# Altium project P10_ESP32.PrjPcb
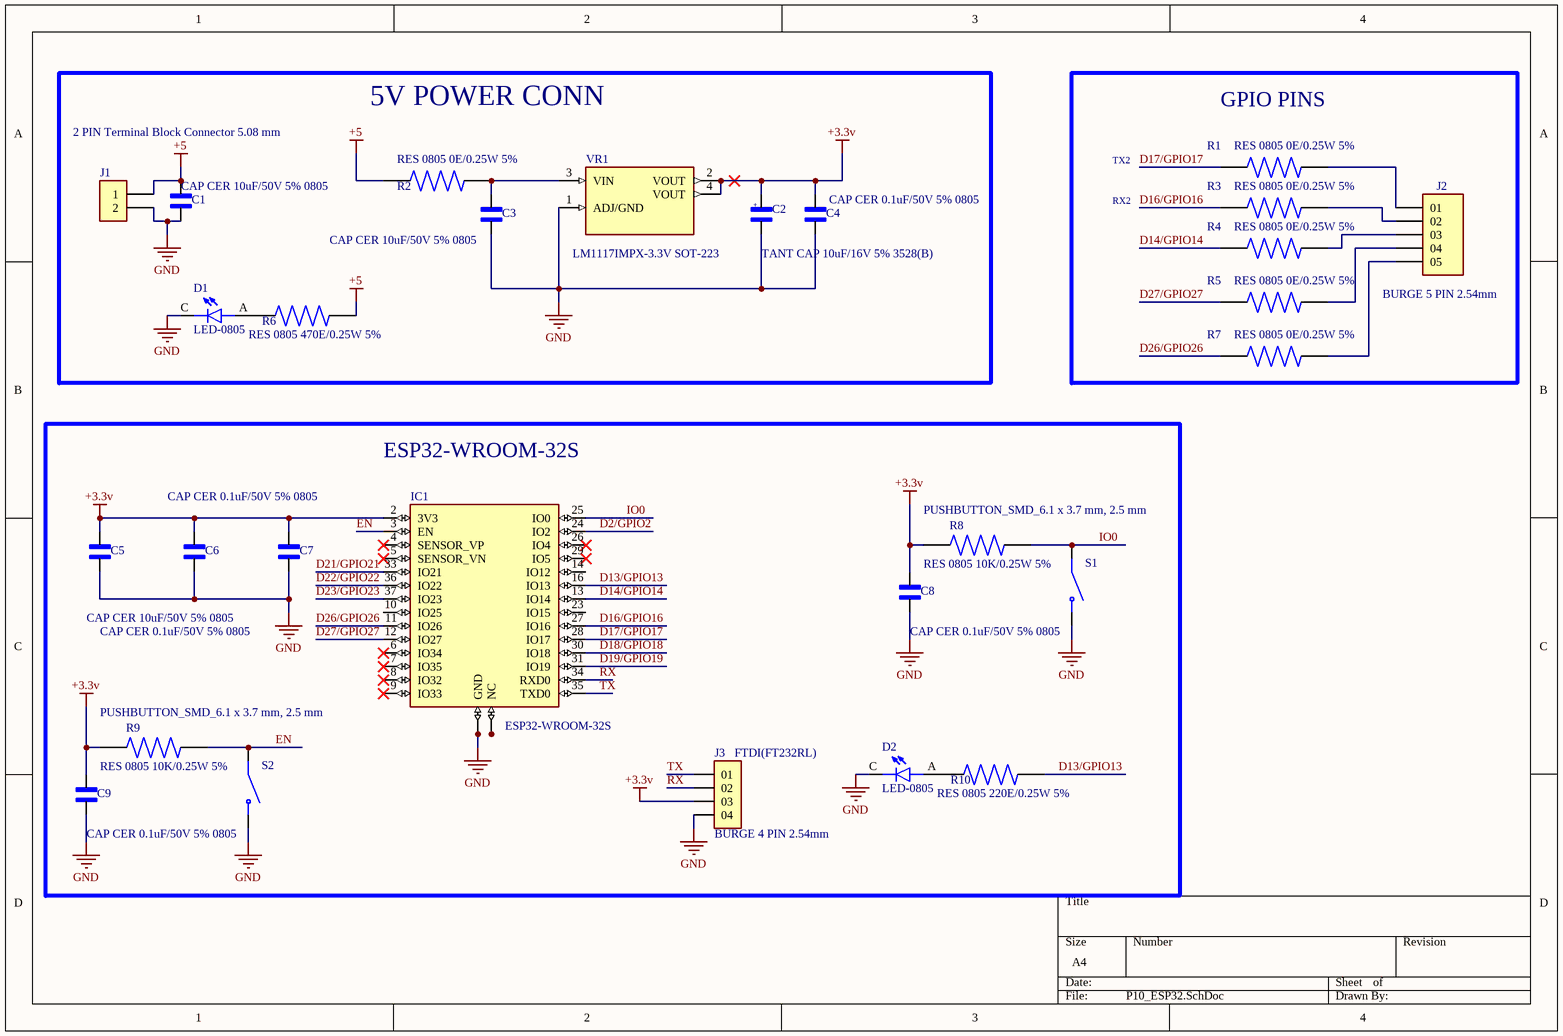
[diagram p0: P10_ESP32.SchDoc]
2 sheets, 56 parts. Net scope: global (net labels, ports and power ports of the same name join across sheets).
Board file: P10_ESP32.PcbDoc
Sheets:
  P10_ESP32.SchDoc
  P10_ESP32_1.SchDoc

## Sheet P10_ESP32.SchDoc
size A4; SheetNumber: 1; SheetTotal: 2

### Parts
C1  CAP CER 10uF/50V 5% 0805  [CAP CER 0.1uF/50V 5%]
C2  TANT CAP 10uF/16V 5% 3528(B)  [TANT CAP 3528(B)]
C3  CAP CER 10uF/50V 5% 0805  [CAP CER 0.1uF/50V 5%]
C4  CAP CER 0.1uF/50V 5% 0805  [CAP CER 0.1uF/50V 5%]
C5  CAP CER 10uF/50V 5% 0805  [CAP CER 0.1uF/50V 5%]
C6  CAP CER 0.1uF/50V 5% 0805  [CAP CER 0.1uF/50V 5%]
C7  CAP CER 0.1uF/50V 5% 0805  [CAP CER 0.1uF/50V 5%]
C8  CAP CER 0.1uF/50V 5% 0805  [CAP CER 0.1uF/50V 5%]
C9  CAP CER 0.1uF/50V 5% 0805  [CAP CER 0.1uF/50V 5%]
D1  LED-0805  [LED-0805]
D2  LED-0805  [LED-0805]
IC1  ESP32-WROOM-32S  [ESP32-WROOM-32S]
J1  2 PIN Terminal Block Connector 5.08 mm  [2 PIN Terminal Block Connector 5.08 mm]
J2  BURGE 5 PIN 2.54mm  [BURGE 5 PIN]
J3  BURGE 4 PIN 2.54mm  [BURGE 4 PIN 2.54mm]
R1  RES 0805 0E/0.25W 5%  [RES 0805 10K/0.25W 5%]
R2  RES 0805 0E/0.25W 5%  [RES 0805 10K/0.25W 5%]
R3  RES 0805 0E/0.25W 5%  [RES 0805 10K/0.25W 5%]
R4  RES 0805 0E/0.25W 5%  [RES 0805 10K/0.25W 5%]
R5  RES 0805 0E/0.25W 5%  [RES 0805 10K/0.25W 5%]
R6  RES 0805 470E/0.25W 5%  [RES 0805 10K/0.25W 5%]
R7  RES 0805 0E/0.25W 5%  [RES 0805 10K/0.25W 5%]
R8  RES 0805 10K/0.25W 5%  [RES 0805 10K/0.25W 5%]
R9  RES 0805 10K/0.25W 5%  [RES 0805 10K/0.25W 5%]
R10  RES 0805 220E/0.25W 5%  [RES 0805 10K/0.25W 5%]
S1  PUSHBUTTON_SMD_6.1 x 3.7 mm, 2.5 mm  [PUSHBUTTON_SMD_6.1 x 3.7 mm, 2.5 mm]
S2  PUSHBUTTON_SMD_6.1 x 3.7 mm, 2.5 mm  [PUSHBUTTON_SMD_6.1 x 3.7 mm, 2.5 mm]
VR1  LM1117IMPX-3.3V SOT-223  [LM1117IMPX-3.3V SOT-223]

### Blocks framed on the sheet
5V POWER CONN: C1-C4 D1 J1 R2 R6 VR1
GPIO PINS: J2 R1 R3-R5 R7
ESP32-WROOM-32S: C5-C9 D2 IC1 J3 R8-R10 S1 S2

### Nets
+3.3v: C2.1 C4.2 C5.2 C6.2 C7.2 C8.2 C9.2 IC1.2(3V3) J3.03 R8.1 R9.1 VR1.2(VOUT) VR1.4(VOUT)
+5: C1.2 J1.1 R2.1 R6.2
GND: C1.1 C2.2 C3.1 C4.1 C5.1 C6.1 C7.1 C8.1 C9.1 D1.C D2.C IC1.1(GND) IC1.15(GND) IC1.38(GND) IC1.39(GND) IC1.40(GND) IC1.41(GND) IC1.42(GND) IC1.43(GND) IC1.44(GND) IC1.45(GND) IC1.46(GND) IC1.47(GND) J1.2 J3.04 S1.2 S2.2 VR1.1(ADJ/GND)
D2/GPIO2: IC1.24(IO2)
D13/GPIO13: IC1.16(IO13) R10.2
D14/GPIO14: IC1.13(IO14) R4.1
D16/GPIO16: IC1.27(IO16) R3.1
D17/GPIO17: IC1.28(IO17) R1.1
D18/GPIO18: IC1.30(IO18)
D19/GPIO19: IC1.31(IO19)
D21/GPIO21: IC1.33(IO21)
D22/GPIO22: IC1.36(IO22)
D23/GPIO23: IC1.37(IO23)
D26/GPIO26: IC1.11(IO26) R7.1
D27/GPIO27: IC1.12(IO27) R5.1
EN: IC1.3(EN) R9.2 S2.1
IO0: IC1.25(IO0) R8.2 S1.1
RX: IC1.34(RXD0) J3.02
TX: IC1.35(TXD0) J3.01
NetC3_2: C3.2 R2.2 VR1.3(VIN)
NetD1_A: D1.A R6.1
NetD2_A: D2.A R10.1
NetIC1_17: IC1.17(NC) IC1.18(NC) IC1.19(NC) IC1.20(NC) IC1.21(NC) IC1.22(NC) IC1.32(NC)
NetJ2_01: J2.01 R1.2
NetJ2_02: J2.02 R3.2
NetJ2_03: J2.03 R4.2
NetJ2_04: J2.04 R5.2
NetJ2_05: J2.05 R7.2

Not connected (* = marked no-connect by the designer): IC1 4(SENSOR_VP)* 5(SENSOR_VN)* 6(IO34)* 7(IO35)* 8(IO32)* 9(IO33)* 10(IO25) 14(IO12) 23(IO15) 26(IO4)* 29(IO5)*

### Notes on the sheet
- TX2
- RX2
- (near J3) FTDI(FT232RL)
- (in symbol TANT CAP 10uF/16V 5% 3528(B)) +

### Library data of the parts
C1 C3-C9 = CAP CER 0.1uF/50V 5%: CAP CER 0.1uF/50V  Ceramic Capacitor X7R 0805 (2012 Metric); MF: Samsung; MP: CL21B104KCFNNNE; Purchase-URL: https://pricing.snapeda.com/search?q=CL21B104KCFNNNE&ref=eda; Package: 0805 Samsung; Check_prices: https://www.snapeda.com/parts/CL21B104KCFNNNE/Samsung+Electro-Mechanics/view-part/?ref=eda; Value: *; SnapEDA_Link: https://www.snapeda.com/parts/CL21B104KCFNNNE/Samsung+Electro-Mechanics/view-part/?ref=snap; Digi-Key_Part_Number: 1276-6840-2-ND
C2 = TANT CAP 10uF/16V 5% 3528(B): 10 ÂµF Molded Tantalum Polymer Capacitor 25 V 1411 (3528 Metric), 1210 150mOhm TCJB106M025R0150; MF: AVX; SnapEDA_Link: https://www.snapeda.com/parts/TCJB106M025R0150/AVX/view-part/?ref=snap; Package: 1210 AVX; Value: *; MP: TCJB106M025R0150; Check_prices: https://www.snapeda.com/parts/TCJB106M025R0150/AVX/view-part/?ref=eda
D1 D2 = LED-0805: Red 640nm LED Indication - Discrete 1.85V 0805 (2012 Metric) APT2012SRCPRV; MF: Kingbright; SnapEDA_Link: https://www.snapeda.com/parts/APT2012SRCPRV/Kingbright/view-part/?ref=snap; Package: 0805 Kingbright; Value: *; MP: APT2012SRCPRV; Check_prices: https://www.snapeda.com/parts/APT2012SRCPRV/Kingbright/view-part/?ref=eda
IC1 = ESP32-WROOM-32S: Bluetooth, WiFi 802.11b/g/n, Bluetooth v4.2 +EDR, Class 1, 2 and 3 Transceiver Module 2.4GHz ~ 2.5GHz PCB Trace Surface Mount; MF: Espressif Systems; MP: ESP32-WROOM-32E-N8; SnapEDA_Link: https://www.snapeda.com/parts/ESP32-WROOM-32E-N8/Espressif+Systems/view-part/?ref=snap; Package: SMD-44 Espressif Systems; Value: *; Check_prices: https://www.snapeda.com/parts/ESP32-WROOM-32E-N8/Espressif+Systems/view-part/?ref=eda
J1 = 2 PIN Terminal Block Connector 5.08 mm: MOLEX,Screw Type, Horizontal, 5.08 Pitch, 24~12 (AWG), Terminal Block Connector, TB007-508-02BE; MF: Same Sky; SnapEDA_Link: https://www.snapeda.com/parts/TB007-508-02BE/Same+Sky/view-part/?ref=snap; Package: None; Value: *; MP: TB007-508-02BE; Check_prices: https://www.snapeda.com/parts/TB007-508-02BE/Same+Sky/view-part/?ref=eda
J2 = BURGE 5 PIN: MTSW-105-07-T-S-048 BURGE 5 PIN 2.54mm; MP: MTSW-105-07-T-S-048; Price: None; Package: None; Value: *; Availability: Unavailable
J3 = BURGE 4 PIN 2.54mm: Conn Unshrouded Header HDR 4 POS 2.54mm Solder ST Top Entry Thru-Hole Bulk TSW-104-17-G-S-LL; MF: Samtec; MP: TSW-104-23-H-S-LL; SnapEDA_Link: https://www.snapeda.com/parts/TSW-104-23-H-S-LL/Samtec/view-part/?ref=snap; Package: None; Value: *; Check_prices: https://www.snapeda.com/parts/TSW-104-23-H-S-LL/Samtec/view-part/?ref=eda
R1-R10 = RES 0805 10K/0.25W 5%: RESISTOR, THICK FILM, 10K, 5%, 0805, FRESISTOR, THICK FILM, 10K, 5%, 0805, FULL REEL Product Range:PANASONIC - ERJ Series; MP: ERJ-6GEYJ103V; MF: Panasonic Electronic; Price: None; Check_prices: https://www.snapeda.com/parts/ERJ-6GEYJ103V/Panasonic+Electronic+Components/view-part/?ref=eda; Package: 805-2 Panasonic; Purchase-URL: https://pricing.snapeda.com/search/part/ERJ-6GEYJ103V/?ref=eda; Availability: In Stock; SnapEDA_Link: https://www.snapeda.com/parts/ERJ-6GEYJ103V/Panasonic+Electronic+Components/view-part/?ref=snap; Value: *
S1 S2 = PUSHBUTTON_SMD_6.1 x 3.7 mm, 2.5 mm: 6.1 x 3.7 mm, 2.5 mm Actuator Height, 260 gf, Red, Surface Mount, SPST, Tactile Switch, TS09-63-25-R-260-SMT-TR; MF: Same Sky; SnapEDA_Link: https://www.snapeda.com/parts/TS09-63-25-R-260-SMT-TR/Same+Sky/view-part/?ref=snap; Package: None; Value: *; MP: TS09-63-25-R-260-SMT-TR; Check_prices: https://www.snapeda.com/parts/TS09-63-25-R-260-SMT-TR/Same+Sky/view-part/?ref=eda
VR1 = LM1117IMPX-3.3V SOT-223: LM1117IMPX-3.3V 800-mA 15-V linear voltage regulator SOT-223; MF: Texas Instruments; MP: LM1117IMPX-5.0/NOPB; SnapEDA_Link: https://www.snapeda.com/parts/LM1117IMPX-5.0/NOPB/Texas+Instruments/view-part/?ref=snap; Package: SOT-223-4 Texas Instruments; Value: *; Check_prices: https://www.snapeda.com/parts/LM1117IMPX-5.0/NOPB/Texas+Instruments/view-part/?ref=eda

## Sheet P10_ESP32_1.SchDoc
size A4; SheetNumber: 2; SheetTotal: 2
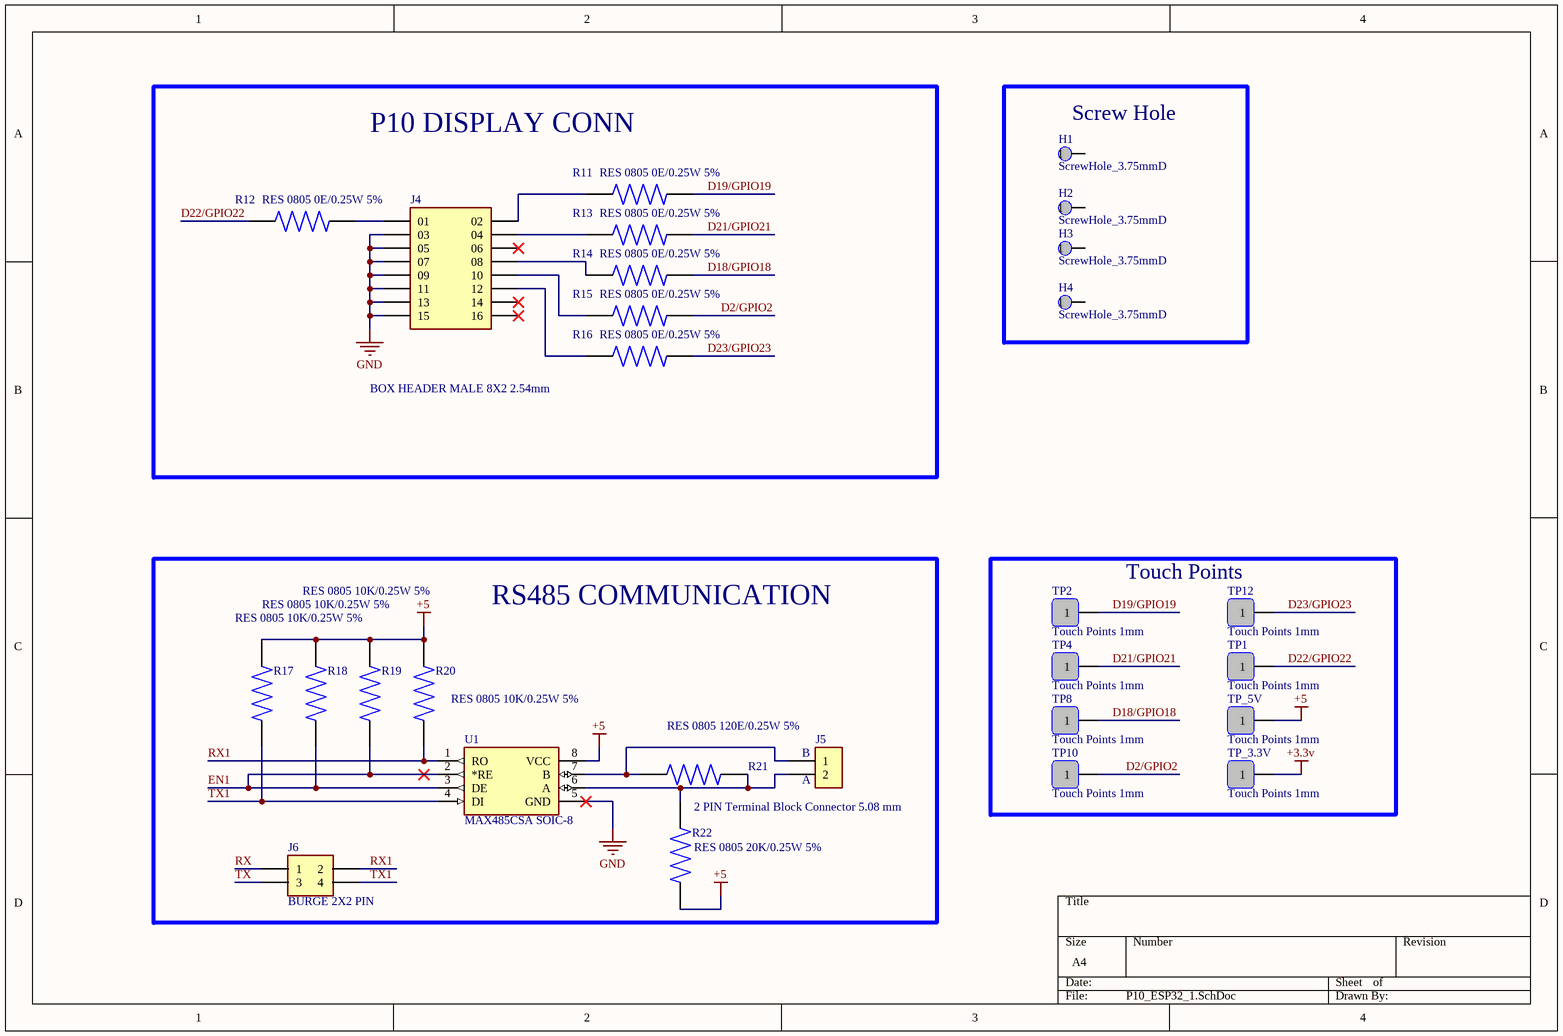
[diagram p1: P10_ESP32_1.SchDoc]

### Parts
H1  ScrewHole_3.75mmD  [ScrewHole_3.75mmD]
H2  ScrewHole_3.75mmD  [ScrewHole_3.75mmD]
H3  ScrewHole_3.75mmD  [ScrewHole_3.75mmD]
H4  ScrewHole_3.75mmD  [ScrewHole_3.75mmD]
J4  BOX HEADER MALE 8X2 2.54mm  [BOX HEADER MALE 8X2 2.54mm]
J5  2 PIN Terminal Block Connector 5.08 mm  [2 PIN Terminal Block Connector 5.08 mm]
J6  BURGE 2X2 PIN  [BURGE 2X2 pin]
R11  RES 0805 0E/0.25W 5%  [RES 0805 10K/0.25W 5%]
R12  RES 0805 0E/0.25W 5%  [RES 0805 10K/0.25W 5%]
R13  RES 0805 0E/0.25W 5%  [RES 0805 10K/0.25W 5%]
R14  RES 0805 0E/0.25W 5%  [RES 0805 10K/0.25W 5%]
R15  RES 0805 0E/0.25W 5%  [RES 0805 10K/0.25W 5%]
R16  RES 0805 0E/0.25W 5%  [RES 0805 10K/0.25W 5%]
R17  RES 0805 10K/0.25W 5%  [RES 0805 10K/0.25W 5%]
R18  RES 0805 10K/0.25W 5%  [RES 0805 10K/0.25W 5%]
R19  RES 0805 10K/0.25W 5%  [RES 0805 10K/0.25W 5%]
R20  RES 0805 10K/0.25W 5%  [RES 0805 10K/0.25W 5%]
R21  RES 0805 120E/0.25W 5%  [RES 0805 10K/0.25W 5%]
R22  RES 0805 20K/0.25W 5%  [RES 0805 10K/0.25W 5%]
TP1  Touch Points 1mm  [Touch Points 1mm]
TP2  Touch Points 1mm  [Touch Points 1mm]
TP4  Touch Points 1mm  [Touch Points 1mm]
TP8  Touch Points 1mm  [Touch Points 1mm]
TP10  Touch Points 1mm  [Touch Points 1mm]
TP12  Touch Points 1mm  [Touch Points 1mm]
TP_3.3V  Touch Points 1mm  [Touch Points 1mm]
TP_5V  Touch Points 1mm  [Touch Points 1mm]
U1  MAX485CSA SOIC-8  [MAX485CSA]

### Blocks framed on the sheet
P10 DISPLAY CONN: J4 R11-R16
Screw Hole: H1-H4
RS485 COMMUNICATION: J5 J6 R17-R22 U1
Touch Points: TP1 TP2 TP4 TP8 TP10 TP12 TP_3.3V TP_5V

### Nets
+3.3v: TP_3.3V.1
+5: R17.2 R18.2 R19.2 R20.2 R22.1 TP_5V.1 U1.8(VCC)
GND: J4.03 J4.05 J4.07 J4.09 J4.11 J4.13 J4.15 U1.5(GND)
D2/GPIO2: R15.2 TP10.1
D18/GPIO18: R14.2 TP8.1
D19/GPIO19: R11.2 TP2.1
D21/GPIO21: R13.2 TP4.1
D22/GPIO22: R12.1 TP1.1
D23/GPIO23: R16.2 TP12.1
EN1: R18.1 R19.1 U1.2(*RE) U1.3(DE)
RX: J6.01(1)
RX1: J6.02(2) R20.1 U1.1(RO)
TX: J6.03(3)
TX1: J6.04(4) R17.1 U1.4(DI)
NetJ4_01: J4.01 R12.2
NetJ4_02: J4.02 R11.1
NetJ4_04: J4.04 R13.1
NetJ4_08: J4.08 R14.1
NetJ4_10: J4.10 R15.1
NetJ4_12: J4.12 R16.1
NetJ5_1: J5.1 R21.1 U1.7(B)
NetJ5_2: J5.2 R21.2 R22.2 U1.6(A)

Not connected (* = marked no-connect by the designer): H1 1; H2 1; H3 1; H4 1; J4 06* 14* 16*

### Notes on the sheet
- (near J5) A
- (near J5) B

### Library data of the parts
H1-H4 = ScrewHole_3.75mmD: SCREW HEAD DIA 4.5MM, SREW LEG DIA 3 MM
J4 = BOX HEADER MALE 8X2 2.54mm: BOX HEADER MALE 8X2 2.54mm 16 pin; MP: TSS-108-01-T-D; Availability: Unavailable; Value: *; Price: None; Package: None
J5 = 2 PIN Terminal Block Connector 5.08 mm: as J1 on sheet P10_ESP32; SnapEDA_Link: https://www.snapeda.com/parts/TB007-508-02BE/Same+Sky/view-part/?ref=snap; Package: None; Value: *; MP: TB007-508-02BE; Check_prices: https://www.snapeda.com/parts/TB007-508-02BE/Same+Sky/view-part/?ref=eda
J6 = 4PIN BURGE: Connector Header Through Hole 4 position 0.100 (2.54mm), 2X2 PIN; MF: Samtec; MP: MTLW-102-05-G-D-180; SnapEDA_Link: https://www.snapeda.com/parts/MTLW-102-05-G-D-180/Samtec/view-part/?ref=snap; Package: None; Value: *; Check_prices: https://www.snapeda.com/parts/MTLW-102-05-G-D-180/Samtec/view-part/?ref=eda
R11-R22 = RES 0805 10K/0.25W 5%: as R1 on sheet P10_ESP32; Price: None; Check_prices: https://www.snapeda.com/parts/ERJ-6GEYJ103V/Panasonic+Electronic+Components/view-part/?ref=eda; Package: 805-2 Panasonic; Purchase-URL: https://pricing.snapeda.com/search/part/ERJ-6GEYJ103V/?ref=eda; Availability: In Stock; SnapEDA_Link: https://www.snapeda.com/parts/ERJ-6GEYJ103V/Panasonic+Electronic+Components/view-part/?ref=snap; Value: *
TP1 TP2 TP4 TP8 TP10 TP12 TP_3.3V TP_5V = Touch Points: Touch Points 0.75mm to1mm
U1 = MAX485CSA: MAX485CSA-RS-485/RS-422 Transceivers, SOIC-8; MF: Analog Devices; MP: MAX485CSA+; SnapEDA_Link: https://www.snapeda.com/parts/MAX485CSA+/Analog+Devices/view-part/?ref=snap; Package: SOIC-8 Maxim; Value: *; Check_prices: https://www.snapeda.com/parts/MAX485CSA+/Analog+Devices/view-part/?ref=eda

## Nets that join several sheets
+3.3v: P10_ESP32 (13 pins), P10_ESP32_1 (TP_3.3V.1)
+5: P10_ESP32 (C1.2 J1.1 R2.1 R6.2), P10_ESP32_1 (7 pins)
GND: P10_ESP32 (28 pins), P10_ESP32_1 (8 pins)
D2/GPIO2: P10_ESP32 (IC1.24), P10_ESP32_1 (R15.2 TP10.1)
D18/GPIO18: P10_ESP32 (IC1.30), P10_ESP32_1 (R14.2 TP8.1)
D19/GPIO19: P10_ESP32 (IC1.31), P10_ESP32_1 (R11.2 TP2.1)
D21/GPIO21: P10_ESP32 (IC1.33), P10_ESP32_1 (R13.2 TP4.1)
D22/GPIO22: P10_ESP32 (IC1.36), P10_ESP32_1 (R12.1 TP1.1)
D23/GPIO23: P10_ESP32 (IC1.37), P10_ESP32_1 (R16.2 TP12.1)
RX: P10_ESP32 (IC1.34 J3.02), P10_ESP32_1 (J6.01)
TX: P10_ESP32 (IC1.35 J3.01), P10_ESP32_1 (J6.03)